# EAGLE schematic upanel (EAGLE 5.06)
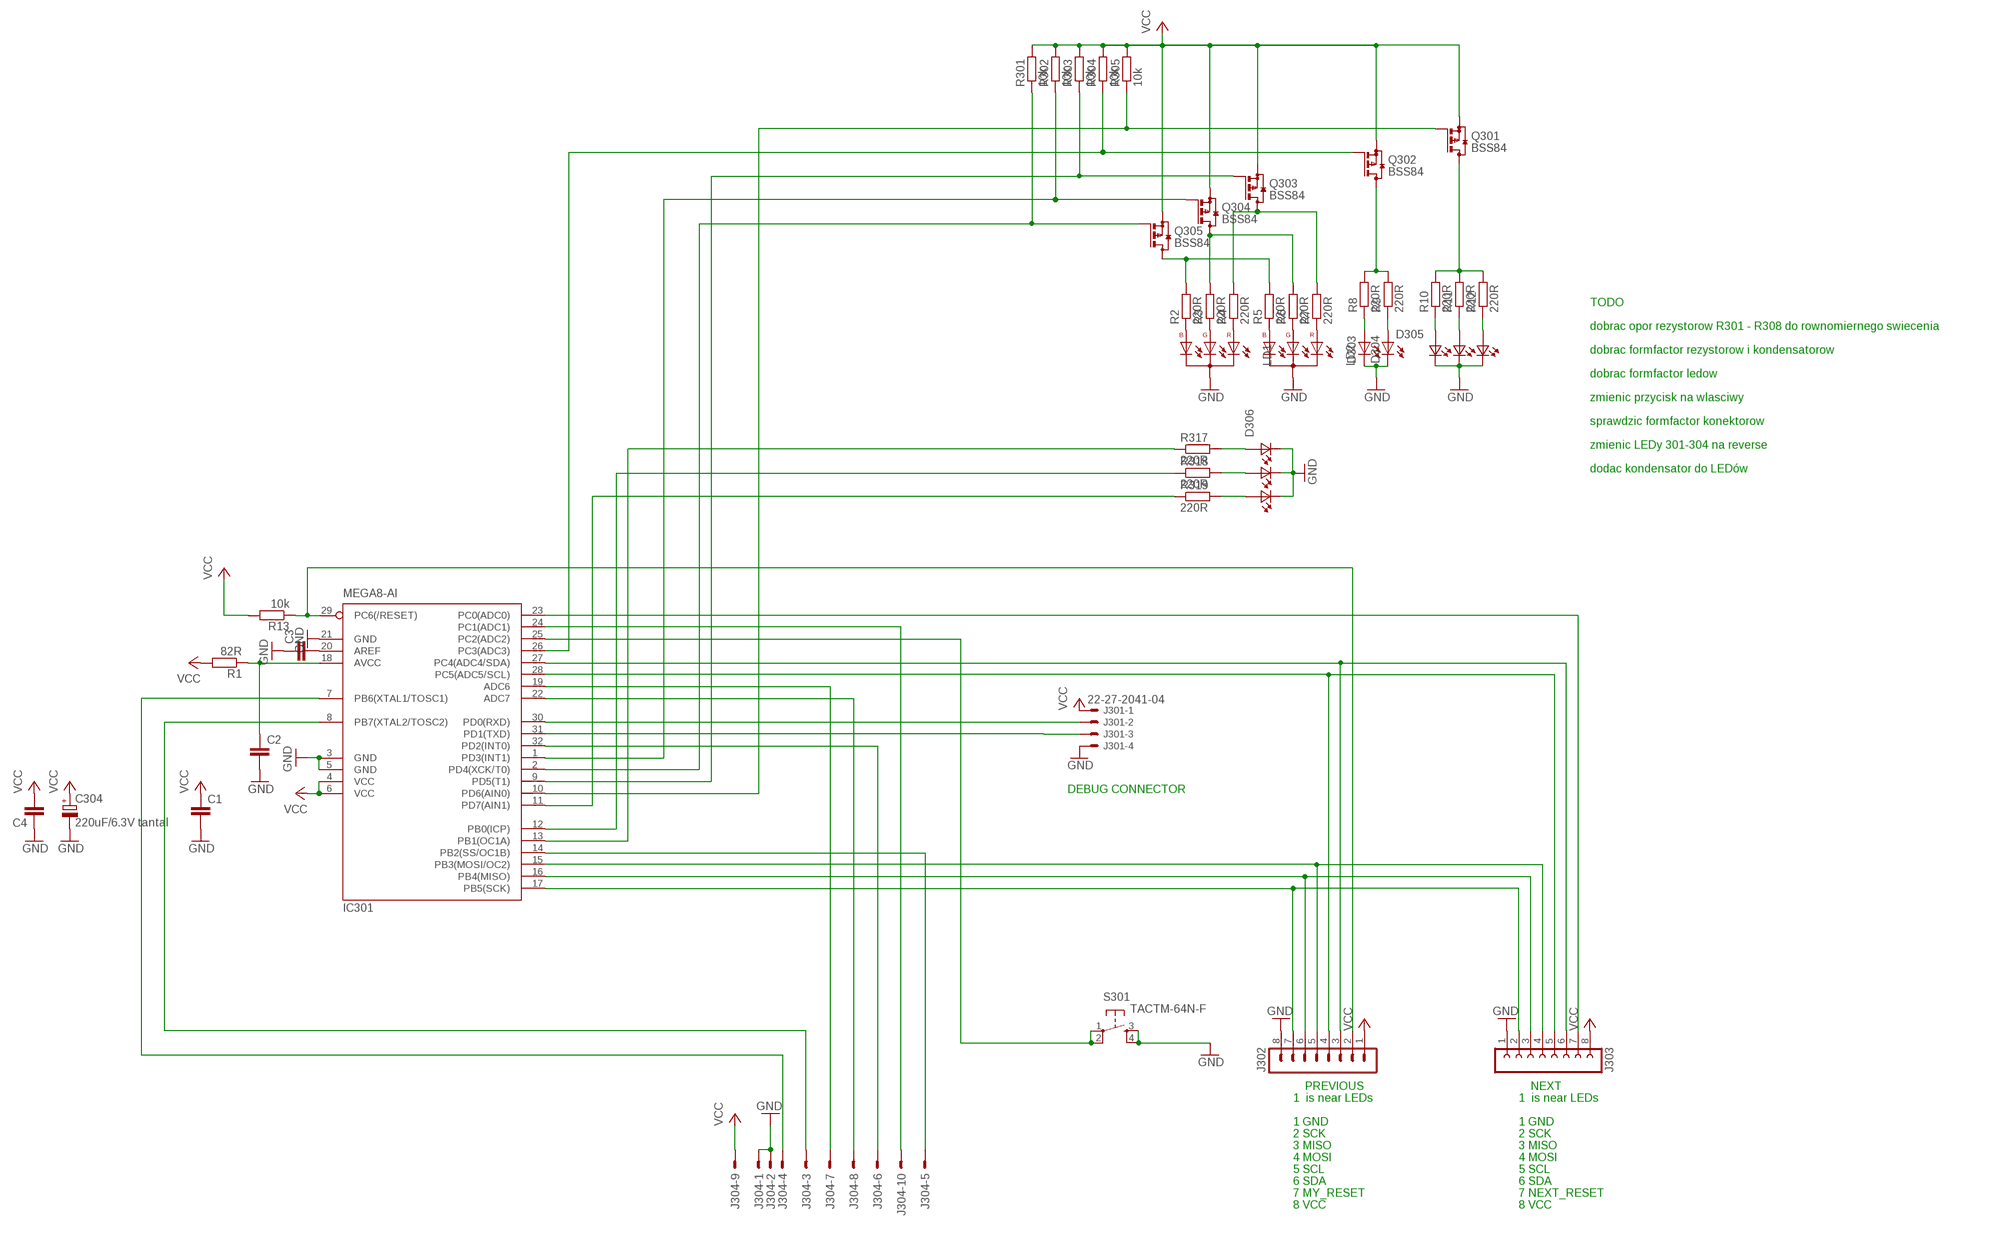
[diagram p0: schematic, sheet 1]

## Parts
C1  CAP  [0805]
C2  CAP  [0805]
C3  CAP  [0805]
C4  CAP  [0805]
C304  220uF/6.3V tantal  CPOL-EUSMCB  [SMC_B]
D303  LED5MM  [LED5MM]
D304  LED5MM  [LED5MM]
D305  TOPLED-3  [P-LCC-4-3]
D306  TOPLED-3  [P-LCC-4-3]
IC301  MEGA8-AI  [TQFP32-08]
J301  22-27-2041-04  [6410-04]
J302  MA08-1W  [MA08-1W]
J303  FE08W  [FE08W]
J304  ML10E  [ML10]
LD1  LED-RGB-CC  [LED-5-RGB]
LD2  LED-RGB-CC  [LED-5-RGB]
Q301  BSS84  [SOT23]
Q302  BSS84  [SOT23]
Q303  BSS84  [SOT23]
Q304  BSS84  [SOT23]
Q305  BSS84  [SOT23]
R1  82R  RES0805  [0805]
R2  220R  RES0805  [0805]
R3  220R  RES0805  [0805]
R4  220R  RES0805  [0805]
R5  220R  RES0805  [0805]
R6  220R  RES0805  [0805]
R7  220R  RES0805  [0805]
R8  220R  RES0805  [0805]
R9  220R  RES0805  [0805]
R10  220R  RES0805  [0805]
R11  220R  RES0805  [0805]
R12  220R  RES0805  [0805]
R13  10k  RES0805  [0805]
R301  10k  RES0805  [0805]
R302  10k  RES0805  [0805]
R303  10k  RES0805  [0805]
R304  10k  RES0805  [0805]
R305  10k  RES0805  [0805]
R317  220R  R-EU_R0805  [R0805]
R318  220R  R-EU_R0805  [R0805]
R319  220R  R-EU_R0805  [R0805]
S301  TACTM-64N-F  DTSM-6  [DTSM-6]

## Nets
GND: C1.2 C2.2 C3.1 C4.1 C304.- D303.K(C) D304.K(C) D305.1(C3) D305.2(C2) D305.3(C1) D306.1(C3) D306.2(C2) D306.3(C1) IC301.3(GND) IC301.5(GND) IC301.21(GND) J301.4 J302.8 J303.1 J304.1 J304.2 LD1.2(C) LD2.2(C) S301.3 S301.4
MISO: IC301.16(PB4(MISO)) J302.6 J303.3
MOSI: IC301.15(PB3(MOSI/OC2)) J302.5 J303.4
N$1: D303.A R8.1
N$2: D305.6(A3) R10.1
N$3: Q303.3(D) R4.2 R7.2
N$4: D305.4(A1) R12.1
N$5: Q302.3(D) R8.2 R9.2
N$6: D306.4(A1) R319.2
N$7: D306.5(A2) R318.2
N$8: D306.6(A3) R317.2
N$9: IC301.13(PB1(OC1A)) R317.1
N$10: IC301.29(PC6(/RESET)) J302.2 R13.1
N$11: IC301.8(PB7(XTAL2/TOSC2)) J304.3
N$12: IC301.26(PC3(ADC3)) Q302.1(G) R304.1
N$13: IC301.9(PD5(T1)) Q303.1(G) R303.1
N$14: IC301.1(PD3(INT1)) Q304.1(G) R302.1
N$15: D304.A R9.1
N$16: D305.5(A2) R11.1
N$17: IC301.11(PD7(AIN1)) R319.1
N$18: IC301.2(PD4(XCK/T0)) Q305.1(G) R301.1
N$19: IC301.25(PC2(ADC2)) S301.1 S301.2
N$20: IC301.12(PB0(ICP)) R318.1
N$21: IC301.10(PD6(AIN0)) Q301.1(G) R305.1
N$22: Q301.3(D) R10.2 R11.2 R12.2
N$23: LD2.3(BA) R5.1
N$25: IC301.7(PB6(XTAL1/TOSC1)) J304.4
N$26: IC301.23(PC0(ADC0)) J303.7
N$31: IC301.31(PD1(TXD)) J301.3
N$32: C3.2 IC301.20(AREF)
N$33: C2.1 IC301.18(AVCC) R1.1
N$36: IC301.19(ADC6) J304.7
N$37: IC301.22(ADC7) J304.8
N$39: IC301.30(PD0(RXD)) J301.2
N$40: IC301.24(PC1(ADC1)) J304.10
N$41: IC301.32(PD2(INT0)) J304.6
N$43: IC301.14(PB2(SS/OC1B)) J304.5
N$47: LD2.4(GA) R6.1
N$49: Q305.3(D) R2.2 R5.2
N$50: LD2.1(RA) R7.1
N$52: Q304.3(D) R3.2 R6.2
N$56: LD1.3(BA) R2.1
N$57: LD1.4(GA) R3.1
N$58: LD1.1(RA) R4.1
SCK: IC301.17(PB5(SCK)) J302.7 J303.2
SCL: IC301.28(PC5(ADC5/SCL)) J302.4 J303.5
SDA: IC301.27(PC4(ADC4/SDA)) J302.3 J303.6
VCC: C1.1 C4.2 C304.+ IC301.4(VCC) IC301.6(VCC) J301.1 J302.1 J303.8 J304.9 Q301.2(S) Q302.2(S) Q303.2(S) Q304.2(S) Q305.2(S) R1.2 R13.2 R301.2 R302.2 R303.2 R304.2 R305.2

## Notes on the sheet
- TODO
- dobrac opor rezystorow R301 - R308 do rownomiernego swiecenia
- dobrac formfactor rezystorow i kondensatorow
- dobrac formfactor ledow
- zmienic przycisk na wlasciwy
- sprawdzic formfactor konektorow
- zmienic LEDy 301-304 na reverse
- dodac kondensator do LEDów
- DEBUG CONNECTOR
- PREVIOUS | NEXT
- 1  is near LEDs | 1  is near LEDs
- 1 GND | 1 GND
- 2 SCK | 2 SCK
- 3 MISO | 3 MISO
- 4 MOSI | 4 MOSI
- 5 SCL | 5 SCL
- 6 SDA | 6 SDA
- 7 MY_RESET | 7 NEXT_RESET
- 8 VCC | 8 VCC

## Library data of the parts
C1-C4 = barobot:CAP
C304 = rcl:CPOL-EU: POLARIZED CAPACITOR, European symbol
D303 D304 = led:LED: LED OSRAM: - CHIPLED LG R971, LG N971, LY N971, LG Q971, LY Q971, LO R971, LY R971 LH N974, LH R974 LS Q976, LO Q976, LY Q976 LO Q996 - Hyper CHIPLED LW Q18S LB Q993, LB Q99A, LB R99A - SideLED LS A670, LO A670, LY A670, LG A670, LP A670 LB A673, LV A673, LT A673, LW A673 LH A674 LY A675 LS A676, LA A676, LO A676, LY A676, LW A676 LS A679, LY A679, LG A679 - Hyper Micro SIDELED® LS Y876, LA Y876, LO Y876, LY Y876 LT Y87S - SmartLED LW L88C, LW L88S LB L89C, LB L89S, LG L890 LS L89K, LO L89K, LY L89K LS L896, LA L896, LO L896, LY L896 - TOPLED LS T670, LO T670, LY T670, LG T670, LP T670 LSG T670, LSP T670, LSY T670, LOP T670, LYG T670 LG T671, LOG T671, LSG T671 LB T673, LV T673, LT T673, LW T673 LH T674 LS T676, LA T676, LO T676, LY T676, LB T676, LH T676, LSB T676, LW T676 LB T67C, LV T67C, LT T67C, LS T67K, LO T67K, LY T67K, LW E67C LS E67B, LA E67B, LO E67B, LY E67B, LB E67C, LV E67C, LT E67C LW T67C LS T679, LY T679, LG T679 LS T770, LO T770, LY T770, LG T770, LP T770 LB T773, LV T773, LT T773, LW T773 LH T774 LS E675, LA E675, LY E675, LS T675 LS T776, LA T776, LO T776, LY T776, LB T776 LHGB T686 LT T68C, LB T68C - Hyper Mini TOPLED® LB M676 - Mini TOPLED Santana® LG M470 LS M47K, LO M47K, LY M47K Source: http://www.osram.convergy.de LUXEON: - LUMILED® LXK2-PW12-R00, LXK2-PW12-S00, LXK2-PW14-U00, LXK2-PW14-V00 LXK2-PM12-R00, LXK2-PM12-S00, LXK2-PM14-U00 LXK2-PE12-Q00, LXK2-PE12-R00, LXK2-PE12-S00, LXK2-PE14-T00, LXK2-PE14-U00 LXK2-PB12-K00, LXK2-PB12-L00, LXK2-PB12-M00, LXK2-PB14-N00, LXK2-PB14-P00, LXK2-PB14-Q00 LXK2-PR12-L00, LXK2-PR12-M00, LXK2-PR14-Q00, LXK2-PR14-R00 LXK2-PD12-Q00, LXK2-PD12-R00, LXK2-PD12-S00 LXK2-PH12-R00, LXK2-PH12-S00 LXK2-PL12-P00, LXK2-PL12-Q00, LXK2-PL12-R00 Source: www.luxeon.com KINGBRIGHT: KA-3528ASYC Source: www.kingbright.com
D305 D306 = led3:TOPLED-3: OSRAM - Hyper Multi TOPLED® (RGB) LB E673, LV E673, LT E673 - Power TOPLED® Enhanced optical Power LED (HOP2000) LS E67B, LA E67B, LO E67B, LY E67B - Hyper Multi TOPLED® Enhanced optical Power LED (HOP2000 / ATON®) LATB T66B - Hyper Multi TOPLED® Hyper-Bright LED LATB T686 Source: http://www.osram.convergy.de/
IC301 = atmel:MEGA8: MICROCONTROLLER 8 Kbytes FLASH, 1 kbytes SRAM, 512 bytes EEPROM, USART, 6-channel 10 bit ADC, 2-channel 8 bit ADC Pin compatible with Atmega48, ATMega88, ATMega168 Source: avr.lbr
J301 = con-molex:22-?-04: CONNECTOR wire to board 2.54 mm (.1 inch) pitch header
J302 = con-lstb:MA08-1W: PIN HEADER
J303 = con-lsta:FE08W: FEMALE HEADER
J304 = con-ml:ML10E: HARTING
LD1 LD2 = barobot:LED-RGB-CC: RGB LED 3 colors (red/green/blue), 5 mm, round, common Cathode
Q301-Q305 = transistor-small-signal:BSS84: P-CHANNEL MOS FET
R1-R13 R301-R305 = barobot:RES
R317-R319 = resistor:R-EU_: RESISTOR, European symbol
S301 = switch-tact:DTSM-6